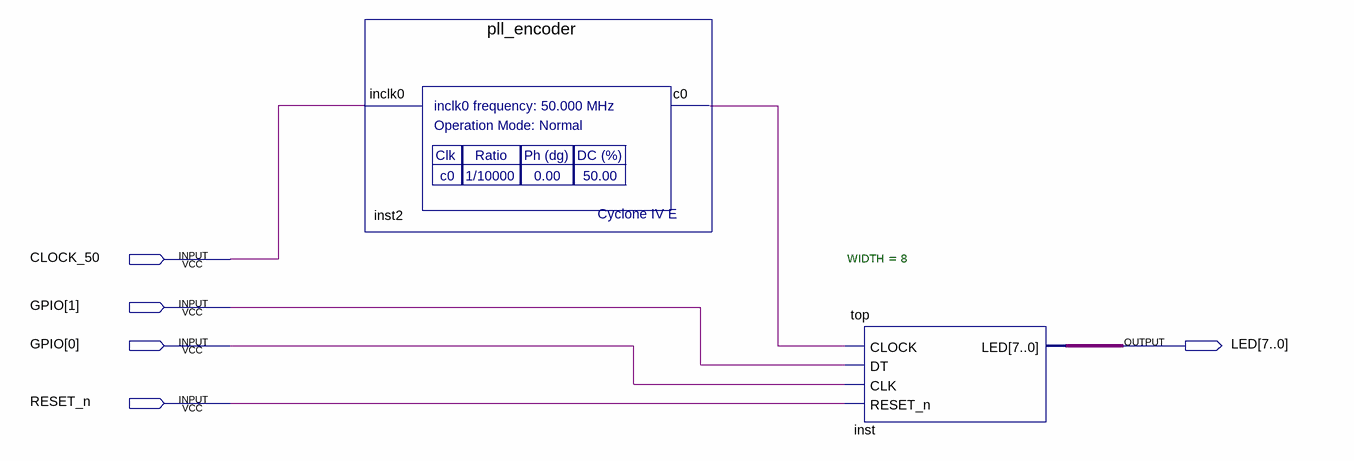
[diagram p0: schematic sheet]
// Quartus schematic Block1.bdf as structural Verilog: 2 symbols, 5 pins
module Block1 (
  input  CLOCK_50,
  input  [1:0] GPIO,
  input  RESET_n,
  output [7:0] LED
);

  wire inst2_c0;

  pll_encoder inst2 (.inclk0(CLOCK_50), .c0(inst2_c0));
  top #(.WIDTH(8)) inst (.CLOCK(inst2_c0), .DT(GPIO[1]), .CLK(GPIO[0]), .RESET_n(RESET_n), .LED(LED));
endmodule
